# Altium schematic sheet fire_warning.SchDoc
size 431 x 279 mm; Organization: ORGANIZATION; Address1: ADDRESS 1; Address2: ADDRESS 2; Address3: ADDRESS 3; Address4: ADDRESS 4; Revision: -; SheetNumber: 1; SheetTotal: 1; ENG_APP_DATE: --/--/--; DSN_APP_DATE: --/--/--; CHK_APP_DATE: --/--/--
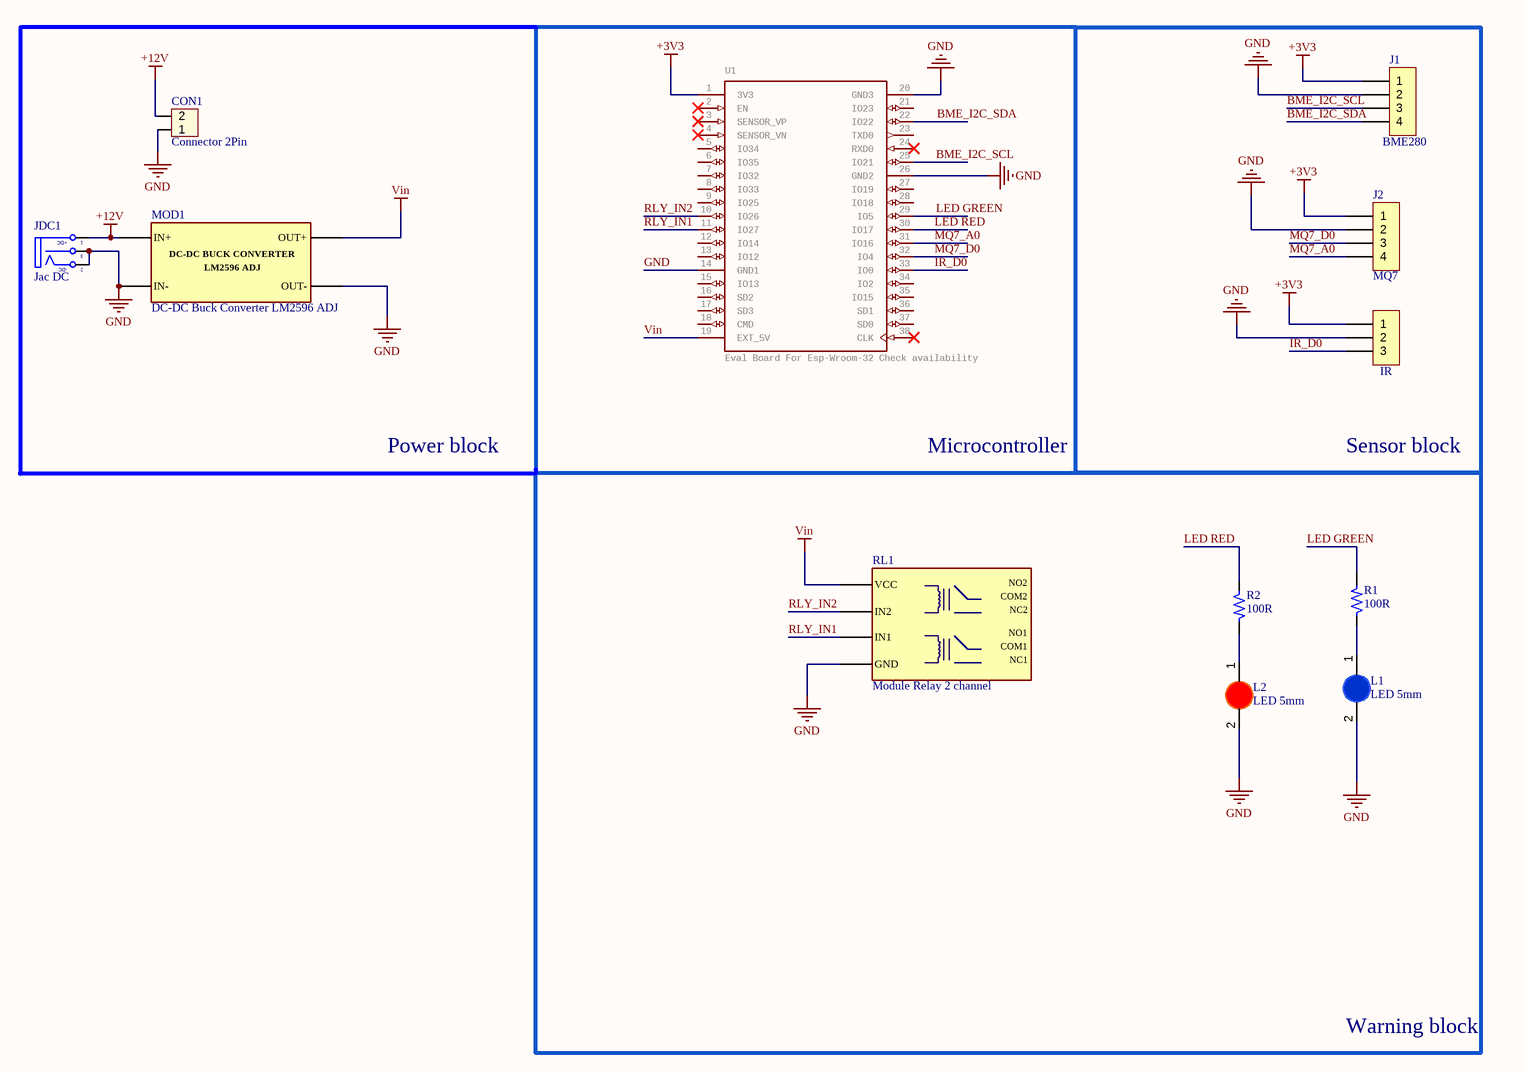
[diagram p0: fire_warning.SchDoc]

## Parts
CON1  Connector 2Pin  [Connector 2 Pin]
J1  BME280  [XH2.54M-4]
J2  MQ7  [XH2.54M-4]
J3  IR  [XH2.54M-3]
JDC1  Jac DC  [DC-IN]
L1  LED 5mm  [LED-5MM-BLUE]
L2  LED 5mm  [LED-5MM-RED]
MOD1  DC-DC Buck Converter LM2596 ADJ  [Module DC-DC Buck Converter LM2596]
R1  100R  [Res 1/4W]
R2  100R  [Res 1/4W]
RL1  Module Relay 2 channel  [RLY 2 Channel]
U1  Eval Board For Esp-Wroom-32 Check availability  [MODULE_ESP32-DEVKITC-32D]

## Blocks framed on the sheet
Microcontroller: U1
Sensor block: J1-J3
Warning block: L1 L2 R1 R2 RL1

## Nets
+3V3: J1.1 J2.1 J3.1 U1.1(3V3)
+12V: CON1.2 JDC1.1(T) MOD1.1(IN+)
GND: CON1.1 J1.2 J2.2 J3.2 JDC1.2(TN) JDC1.3(S) L1.2(K) L2.2(K) MOD1.2(IN-) MOD1.4(OUT-) RL1.4(GND) U1.14(GND1) U1.20(GND3) U1.26(GND2)
Vin: MOD1.3(OUT+) RL1.1(VCC) U1.19(EXT_5V)
BME_I2C_SCL: J1.3 U1.25(IO21)
BME_I2C_SDA: J1.4 U1.22(IO22)
IR_D0: J3.3 U1.33(IO0)
LED GREEN: R1.2 U1.29(IO5)
LED RED: R2.1 U1.30(IO17)
MQ7_A0: J2.4 U1.31(IO16)
MQ7_D0: J2.3 U1.32(IO4)
RLY_IN1: RL1.3(IN1) U1.11(IO27)
RLY_IN2: RL1.2(IN2) U1.10(IO26)
NetL1_1: L1.1(A) R1.1
NetL2_1: L2.1(A) R2.2

Not connected (* = marked no-connect by the designer): U1 2(EN)* 3(SENSOR_VP)* 4(SENSOR_VN)* 5(IO34) 6(IO35) 7(IO32) 8(IO33) 9(IO25) 12(IO14) 13(IO12) 15(IO13) 16(SD2) 17(SD3) 18(CMD) 21(IO23) 23(TXD0) 24(RXD0)* 27(IO19) 28(IO18) 34(IO2) 35(IO15) 36(SD1) 37(SD0) 38(CLK)*

## Notes on the sheet
- Power block
- DWG. NO.
- REV.
- SHT.
- THIS DOCUMENT AND THE DATA DISCLOSED HEREIN OR HEREWITH IS THE PROPERTY OF ALTIUM LIMITED AND MAY BE FREELY DISTRIBUTED IN WHOLE. NO RIGHTS ARE RESERVED OR EXPRESS OR IMPLIED WARANTEE GIVEN.
- REVISION
- DESCRIPTION
- DATE
- APPROVED
- ENG:
- APPROVALS
- PROJECT
- DSN:
- CHK:
- REFERENCE DOCUMENTS
- PROJECT REVISION:
- TITLE
- DOCUMENT REVISION:
- DESIGN ITEM:
- BOM:
- FAB DWG:
- PCB DWG:
- ASSY DWG:
- SCALE:
- SIZE
- B
- CAGE CODE
- FILE NAME
- DWG NO.
- SHEET
- OF
- REV
- (in symbol DCIN) +DC; -DC
- (in symbol MOD-DC-DC_Buck_LM2596_3A) DC-DC BUCK CONVERTER; LM2596 ADJ
- (in symbol RLY2_5V_80mA) NO2; COM2; NC2; NO1; COM1; NC1

## Library data of the parts
CON1 = Connector 2Pin: Value: Header 2
J1 J2 = CON 4-Pin: Pitch 2.54mm; Ten_Linh_Kien: Header 4P XH2.54-4P Đực Thẳng; Don_Vi: Con; Ma_Hang: MH001285; Chung_Loai: Cắm
J3 = CON 3-Pin: Ten_Linh_Kien: Header 3P XH2.54-3P Đực Thẳng; Don_Vi: Con; Ma_Hang: MH001292; Chung_Loai: Cắm
JDC1 = DCIN: Jac DC input; Value: Jac DC
L1 = LED 5mm Xanh Duong: Cắm; Don_Vi: Con; Ma_Hang: MH008987; Ten_Linh_Kien: Led 5MM Xanh Dương Đục (1000c); Ghi_Chu: *; Kieu_Chan: *; Chung_Loai: Cắm
L2 = LED 5mm Do: Cắm; Don_Vi: Con; Ma_Hang: MH008967; Ten_Linh_Kien: Led 5MM Phủ Đỏ (1000c); Ghi_Chu: *; Kieu_Chan: *; Chung_Loai: Cắm
MOD1 = MOD-DC-DC_Buck_LM2596_3A: Input: 3-30V, Output:1.5-30V. I_out = 3A (max). Dimensions: 45x20x14mm
R1 R2 = Res: Resistor; Value: R1/4W - 1K
RL1 = RLY2_5V_80mA: Output: 10A/30VDC, 10A/250VAC
U1 = ESP32-DEVKITC-32D: GateName_1: G$1; MF: Espressif Systems; SymbolName_1: ESP32-DEVKITC-32D; LibraryName: ESP32-DEVKITC-32D; DeviceSetName: ESP32-DEVKITC-32D; Package: MODULE_ESP32-DEVKITC-32D; Package: None; Availability: In Stock; Price: None; Purchase-URL: https://pricing.snapeda.com/search/part/ESP32-DEVKITC-32D/?ref=eda; MP: ESP32-DEVKITC-32D